# EAGLE design sch (EAGLE 6.5.0)
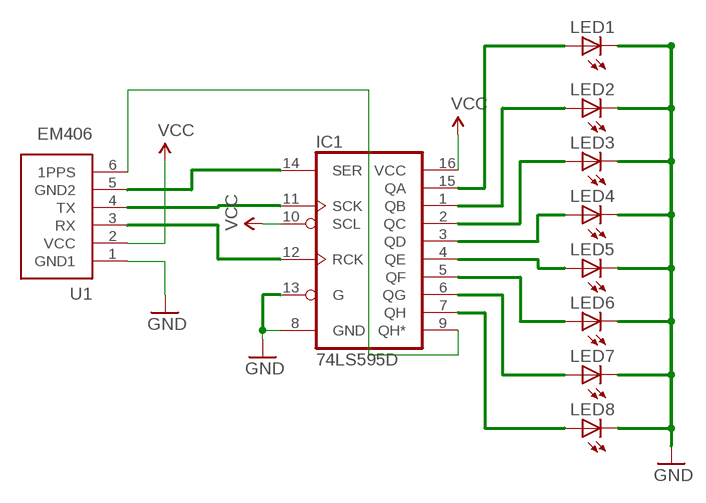
[diagram p0: schematic, sheet 1]

## Parts
IC1  74LS595D  [SO16]
LED1  LED1206  [LED-1206]
LED2  LED1206  [LED-1206]
LED3  LED1206  [LED-1206]
LED4  LED1206  [LED-1206]
LED5  LED1206  [LED-1206]
LED6  LED1206  [LED-1206]
LED7  LED1206  [LED-1206]
LED8  LED1206  [LED-1206]
U1  EM406  [EM406]

## Nets
GND: IC1.8(GND) IC1.13(G) LED1.C LED2.C LED3.C LED4.C LED5.C LED6.C LED7.C LED8.C U1.1(GND1)
N$1: IC1.12(RCK) U1.3(RX)
N$2: IC1.9(QH*) U1.6(1PPS)
N$4: IC1.14(SER) U1.5(GND2)
N$5: IC1.15(QA) LED1.A
N$10: IC1.11(SCK) U1.4(TX)
N$12: IC1.1(QB) LED2.A
N$13: IC1.2(QC) LED3.A
N$14: IC1.3(QD) LED4.A
N$15: IC1.5(QF) LED6.A
N$17: IC1.6(QG) LED7.A
N$18: IC1.7(QH) LED8.A
N$19: IC1.4(QE) LED5.A
VCC: IC1.10(SCL) IC1.16(VCC) U1.2(VCC)

## Library data of the parts
IC1 = SparkFun-DigitalIC:74*595: 8-bit SHIFT REGISTER, output latch
LED1-LED8 = SparkFun-LED:LED: LEDs Standard schematic elements and footprints for 5mm, 3mm, 1206, and 0603 sized LEDs. 5mm - Spark Fun Electronics SKU : COM-00529 (and others)
U1 = SparkFun-Connectors:EM406: EM406 GPS Connector Proven layout and schematic for EM406 connector. Spark Fun Electronics SKU : GPS-00579

## Board
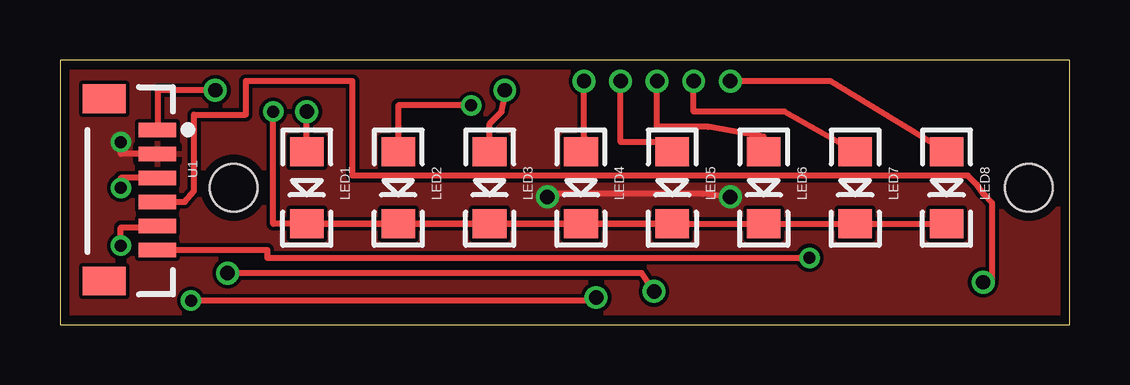
[diagram p1: board, top side]
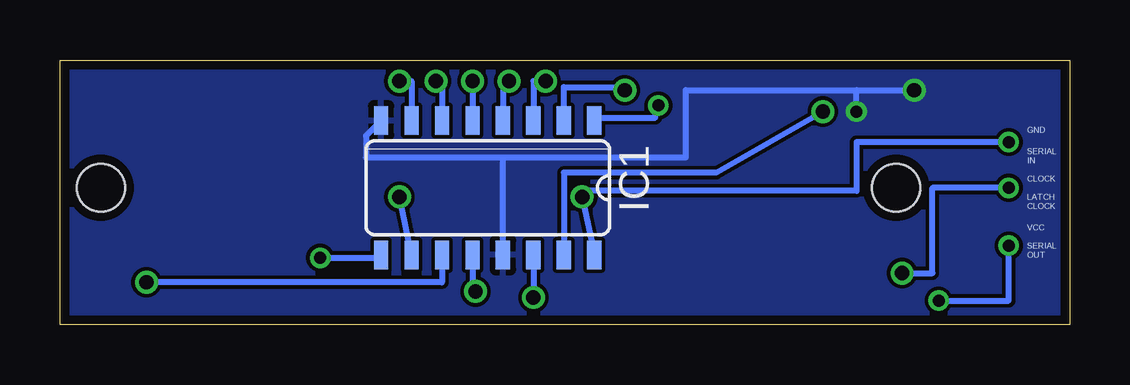
[diagram p2: board, bottom side, seen from below]

Size 42.09 x 11.04 mm. Coordinates in mm from the lower left corner, seen from the top.
Outline: 0,0 42.09,0 42.09,11.04 0,11.04 0,0
Copper layers (1*16): Top 0.0356mm / dielectric 1.5011mm / Bottom 0.0356mm
Design rules "OSHPark": minimum track width 6mil, minimum drill 13mil, track to track 6mil, track to pad 6mil, pad to pad 6mil, via to via 6mil, smd to smd 6mil, copper to edge 15mil, drill to drill 6mil, minimum pad ring 7mil, minimum via ring 7mil, stop-mask expansion 3mil, vias tented up to drill 0mil, thermal gap 10mil
Holes 2 mm at 40.39,5.71 7.24,5.71

### Footprints (pad centres in the part's own frame; a part is rotated, then mirrored left to right if it is on the bottom)
SO16 = smd 0.6 x 1.2: 1 -4.445,-2.8; 2 -3.175,-2.8; 3 -1.905,-2.8; 4 -0.635,-2.8; 5 0.635,-2.8; 6 1.905,-2.8; 7 3.175,-2.8; 8 4.445,-2.8; 9 4.445,2.8; 10 3.175,2.8; 11 1.905,2.8; 12 0.635,2.8; 13 -0.635,2.8; 14 -1.905,2.8; 15 -3.175,2.8; 16 -4.445,2.8
LED-1206 = smd 1.2 x 1.4: A -1.5,0; C 1.5,0
EM406 = smd 0.6 x 1.55: 1 0,0; 2 1,0; 3 2,0; 4 3,0; 5 4,0; 6 5,0 | smd 1.2 x 1.8: P$1 -1.3,-2.225; P$2 6.3,-2.225

### Placement (x,y rotation side)
IC1  24.26,5.71 180 bottom
LED1  10.29,5.71 270 top
LED2  14.1,5.71 270 top
LED3  17.91,5.71 270 top
LED4  21.72,5.71 270 top
LED5  25.53,5.71 270 top
LED6  29.34,5.71 270 top
LED7  33.15,5.71 270 top
LED8  36.96,5.71 270 top
U1  4.06,8.13 270 top

### Tracks (layer width: path | path; a pad name or v marks a point on that pad's centre or on a via)
GND  (via drill 0.5 pad 0.25, 0.6)
  Top 0.254: LED1.C LED2.C LED3.C LED4.C LED5.C | LED5.C LED6.C LED7.C LED8.C | v6.48,9.78 4.06,9.78 U1.1 | LED5.C 8.89,4.21 v8.89,8.89
  Bottom 0.254: IC1.8 29.34,7.88 29.34,6.99 23.62,6.99 | 23.62,6.99 16,6.99 16,9.78 8.89,9.78 | 8.89,9.78 v6.48,9.78 | IC1.13 23.62,6.99 | v8.89,8.89 8.89,9.78
  pour Bottom: -2.03,12.45 42.67,11.94 42.67,-0.76 -2.03,-0.76
N$1  (via drill 0.5 pad 0.25, 0.6 pad 0.25)
  Top 0.254: v24.77,1.4 24.26,2.16 v6.99,2.16 | U1.3 2.54,6.13 v2.54,5.71
  Bottom 0.254: IC1.12 24.89,1.4 v24.77,1.4 | v6.99,2.16 5.71,2.16 5.71,5.71 v2.54,5.71
N$2  (via drill 0.5 pad 0.25)
  Top 0.254: U1.6 8.64,3.13 8.64,2.79 v31.24,2.79
  Bottom 0.254: v31.24,2.79 28.7,2.79 IC1.9
N$4  (via drill 0.5 pad 0.25, 0.6 pad 0.25)
  Top 0.254: v22.35,1.14 21.97,1.02 v5.46,1.02 | v2.54,3.3 2.54,4.06 4.57,4.06 U1.5
  Bottom 0.254: IC1.14 v22.35,1.14 | v5.46,1.02 2.54,1.02 v2.54,3.3
N$5  (via drill 0.6)
  Top 0.254: LED1.A v10.29,8.89
  Bottom 0.254: v10.29,8.89 14.73,6.35 21.08,6.35 IC1.15
N$10  (via drill 0.6 pad 0.25)
  Top 0.254: v38.48,1.78 38.86,1.91 38.86,5.08 38.48,5.46 38.23,5.84 37.85,6.22 12.19,6.22 12.19,10.16 7.75,10.16 7.75,8.76 5.59,8.76 5.59,5.59 5.21,5.13 U1.4
  Bottom 0.254: IC1.11 26.16,1.78 v38.48,1.78
N$12  (via drill 0.5 pad 0.25)
  Top 0.254: v17.14,9.14 14.1,9.14 LED2.A
  Bottom 0.254: IC1.1 19.81,8.64 17.27,8.64 17.27,9.02 v17.14,9.14
N$13  (via drill 0.6)
  Top 0.254: LED3.A 17.91,8.38 18.41,8.89 18.54,9.53 v18.54,9.78
  Bottom 0.254: IC1.2 21.08,9.91 18.54,9.91 v18.54,9.78
N$14  (via drill 0.6)
  Top 0.254: LED4.A 21.84,7.85 v21.84,10.16
  Bottom 0.254: v21.84,10.16 22.35,10.16 IC1.3
N$15  (via drill 0.6)
  Top 0.254: LED6.A 29.34,7.85 27.03,8.26 24.89,8.26 v24.89,10.16
  Bottom 0.254: v24.89,10.16 IC1.5
N$17  (via drill 0.6)
  Top 0.254: LED7.A 30.2,8.89 26.42,8.89 v26.42,10.16
  Bottom 0.254: v26.42,10.16 26.16,10.16 IC1.6
N$18  (via drill 0.6)
  Top 0.254: LED8.A 32.11,10.16 v27.94,10.16
  Bottom 0.254: v27.94,10.16 27.43,10.16 IC1.7
N$19  (via drill 0.6)
  Top 0.254: LED5.A 25.53,7.62 23.37,7.62 v23.37,10.16
  Bottom 0.254: v23.37,10.16 23.62,10.16 IC1.4
VCC  (via drill 0.5 pad 0.25, 0.6 pad 0.25, 0.6 pad 0.41)
  Top 0.254: v27.94,5.33 26.8,5.46 20.45,5.46 v20.32,5.33 | U1.2 2.54,7.13 v2.54,7.62
  Bottom 0.254: IC1.10 v27.94,5.33 | IC1.16 v20.32,5.33 20.32,5.59 8.89,5.59 8.89,7.62 v2.54,7.62
  pour Top: -1.78,12.19 42.67,11.94 42.67,-0.76 -2.03,-0.51

### Text on the board
bNames: GND | IN | SERIAL | CLOCK | CLOCK | LATCH | VCC | OUT | SERIAL